# EAGLE design Spájkovačka 3000 MK.I (EAGLE 7.5.0)
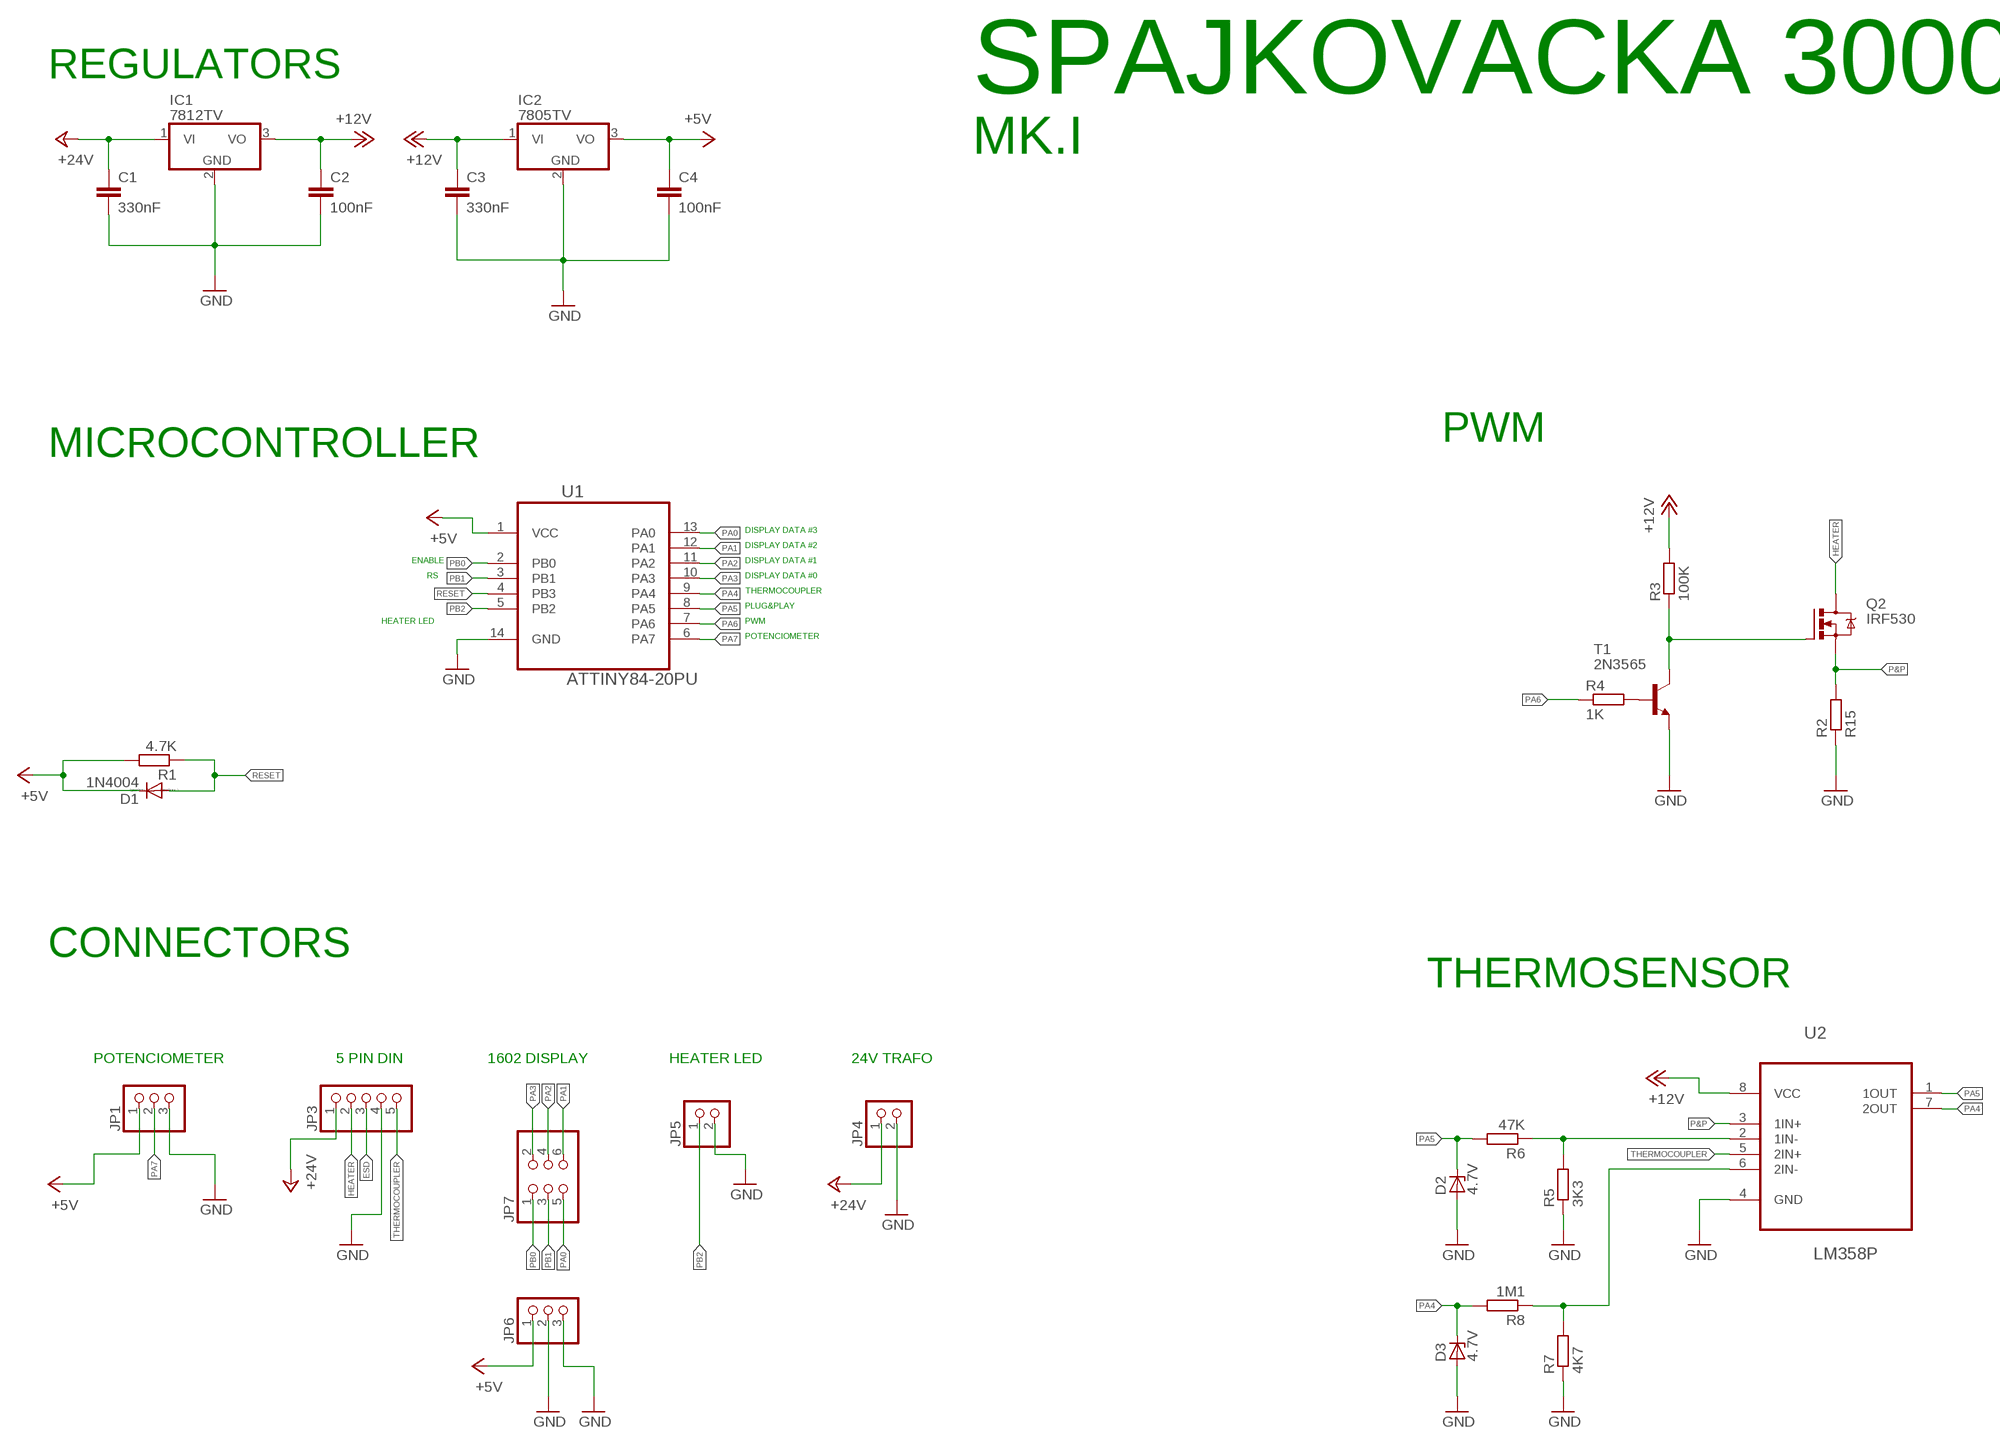
[diagram p0: schematic, sheet 1]

## Parts
C1  330nF  C-EU025-024X044  [C025-024X044]
C2  100nF  C-EU025-024X044  [C025-024X044]
C3  330nF  C-EU025-024X044  [C025-024X044]
C4  100nF  C-EU025-024X044  [C025-024X044]
D1  1N4004  [DO41-10]
D2  4.7V  ZENER-DIODEDO41Z10  [DO41Z10]
D3  4.7V  ZENER-DIODEDO41Z10  [DO41Z10]
IC1  7812TV  [TO220V]
IC2  7805TV  [TO220V]
JP1  PINHD-1X3  [1X03]
JP3  PINHD-1X5  [1X05]
JP4  PINHD-1X2  [1X02]
JP5  PINHD-1X2  [1X02]
JP6  PINHD-1X3  [1X03]
JP7  PINHD-2X3  [2X03]
Q2  IRF530  [TO220BV]
R1  4.7K  R-EU_0207/10  [0207/10]
R2  R15  R-EU_0922/22  [0922/22]
R3  100K  R-EU_0207/10  [0207/10]
R4  1K  R-EU_0207/10  [0207/10]
R5  3K3  R-EU_0207/10  [0207/10]
R6  47K  R-EU_0207/10  [0207/10]
R7  4K7  R-EU_0207/10  [0207/10]
R8  1M1  R-EU_0207/10  [0207/10]
T1  2N3565  [TO92]
U1  ATTINY84-20PU  [DIP254P762X533-14]
U2  LM358P  [DIP254P762X508-8]

## Nets
1IN-: R5.2 R6.1 U2.2(1IN-)
+5V: C4.1 D1.C IC2.3(VO) JP1.1 JP6.1 R1.2 U1.1(VCC)
+12V: C2.1 C3.1 IC1.3(VO) IC2.1(VI) R3.2 U2.8(VCC)
+24V: C1.1 IC1.1(VI) JP3.1 JP4.1
ESD: JP3.3
GND: C1.2 C2.2 C3.2 C4.2 D2.A D3.A IC1.2(GND) IC2.2(GND) JP1.3 JP3.4 JP4.2 JP5.2 JP6.2 JP6.3 R2.1 R5.1 R7.1 T1.3(E) U1.14(GND) U2.4(GND)
HEATER: JP3.2 Q2.D
N$1: R7.2 R8.1 U2.6(2IN-)
N$4: Q2.G R3.1 T1.1(C)
N$7: R4.2 T1.2(B)
P&P: Q2.S R2.2 U2.3(1IN+)
PA0: JP7.5 U1.13(PA0)
PA1: JP7.6 U1.12(PA1)
PA2: JP7.4 U1.11(PA2)
PA3: JP7.2 U1.10(PA3)
PA4: D3.C R8.2 U1.9(PA4) U2.7(2OUT)
PA5: D2.C R6.2 U1.8(PA5) U2.1(1OUT)
PA6: R4.1 U1.7(PA6)
PA7: JP1.2 U1.6(PA7)
PB0: JP7.1 U1.2(PB0)
PB1: JP7.3 U1.3(PB1)
PB2: JP5.1 U1.5(PB2)
RESET: D1.A R1.1 U1.4(PB3)
THERMOCOUPLER: JP3.5 U2.5(2IN+)

## Notes on the sheet
- REGULATORS
- SPAJKOVACKA 3000
- MK.I
- PWM
- MICROCONTROLLER
- DISPLAY DATA #3
- DISPLAY DATA #2
- ENABLE | DISPLAY DATA #1
- RS | DISPLAY DATA #0
- THERMOCOUPLER
- PLUG&PLAY
- HEATER LED | PWM
- POTENCIOMETER
- CONNECTORS
- THERMOSENSOR
- POTENCIOMETER | 5 PIN DIN | 1602 DISPLAY | HEATER LED | 24V TRAFO

## Library data of the parts
C1-C4 = resistor:C-EU: CAPACITOR, European symbol
D1 = diode:1N4004: DIODE general purpose rectifier, 1 A
D2 D3 = diode:ZENER-DIODE: Z-Diode
IC1 IC2 = linear:78*: Positive VOLTAGE REGULATOR Source: http://cache.national.com/ds/LM/LM78L05.pdf http://www.fairchildsemi.com/ds/LM/LM7805.pdf
JP1 JP6 = pinhead:PINHD-1X3: PIN HEADER
JP3 = pinhead:PINHD-1X5: PIN HEADER
JP4 JP5 = pinhead:PINHD-1X2: PIN HEADER
JP7 = pinhead:PINHD-2X3: PIN HEADER
Q2 = IRF530:IRF530: HEXFET Power MOSFET
R1-R8 = resistor:R-EU_: RESISTOR, European symbol
T1 = transistor:2N3565: NPN TRANSISTOR
U1 = ATTINY84-20PU:ATTINY84-20PU: 8-bit Microcontroller with In-System Programmable Flash
U2 = LM358P:LM358P: OPERATIONAL AMPLIFIERS

## Board
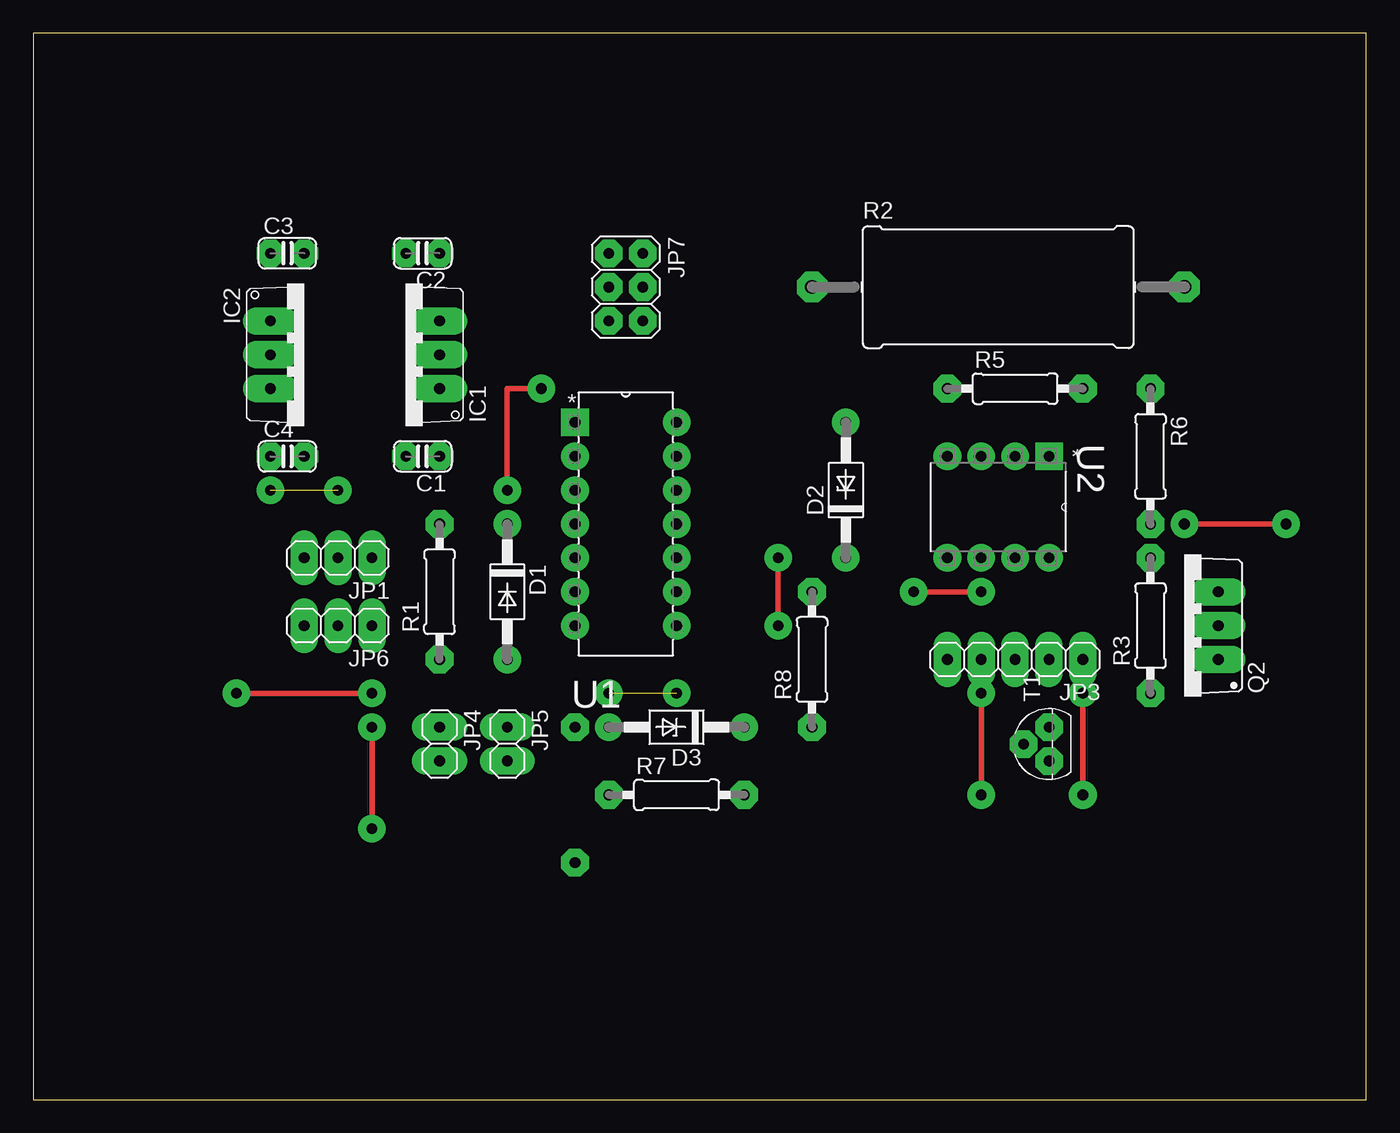
[diagram p1: board, top side]
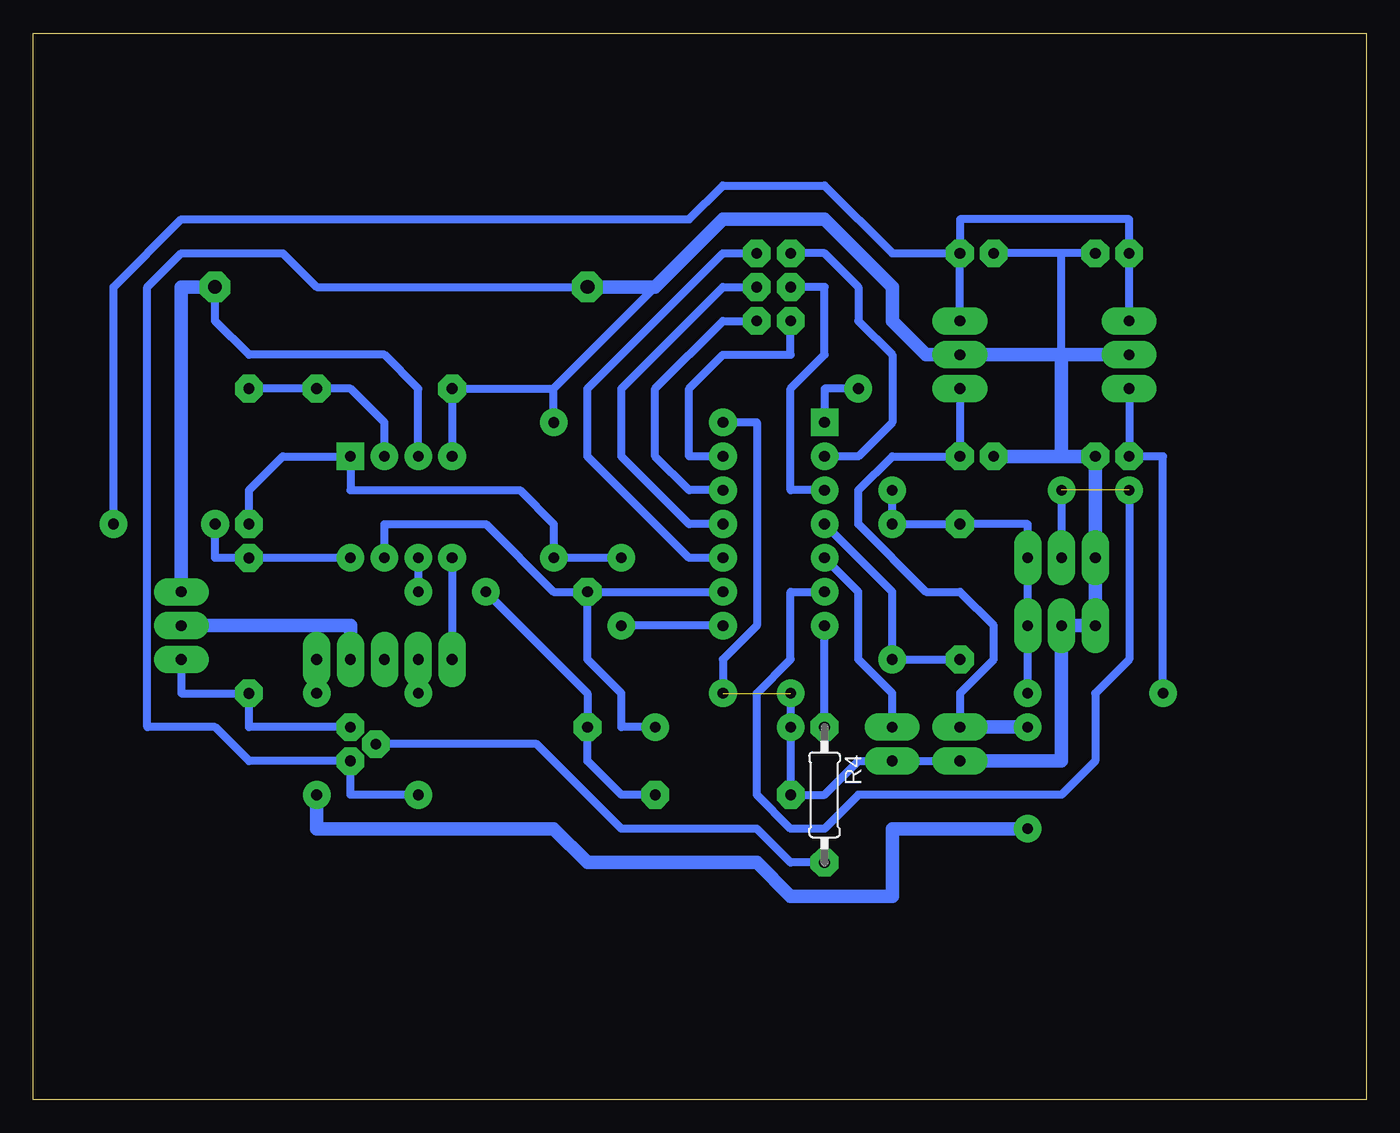
[diagram p2: board, bottom side, seen from below]

Size 100 x 80 mm. Coordinates in mm from the lower left corner, seen from the top.
Outline: 0,0 100,0 100,80 0,80 0,0
Copper layers (1*16): Top 0.035mm / dielectric 1.5mm / Bottom 0.035mm
Design rules "default *": minimum track width 10mil, minimum drill 24mil, track to track 8mil, track to pad 8mil, pad to pad 8mil, via to via 8mil, smd to smd 8mil, copper to edge 40mil, drill to drill 8mil, minimum pad ring 25mil, minimum via ring 25mil, stop-mask expansion 4mil, vias tented up to drill 0mil, thermal gap 10mil

### Footprints (pad centres in the part's own frame; a part is rotated, then mirrored left to right if it is on the bottom)
C025-024X044 = drill 0.8 octagon: 1 -1.27,0; 2 1.27,0
DO41-10 = drill 0.8: A 5.08,0; C -5.08,0
DO41Z10 = drill 0.8: A 5.08,0; C -5.08,0
TO220V = drill 0.8 long: 1 -2.54,-2.54; 2 0,-2.54; 3 2.54,-2.54
1X03 = drill 0.8 long: 1 -2.54,0; 2 0,0; 3 2.54,0
1X05 = drill 0.8 long: 1 -5.08,0; 2 -2.54,0; 3 0,0; 4 2.54,0; 5 5.08,0
1X02 = drill 0.8 long: 1 -1.27,0; 2 1.27,0
2X03 = drill 0.8 octagon: 1 -2.54,-1.27; 2 -2.54,1.27; 3 0,-1.27; 4 0,1.27; 5 2.54,-1.27; 6 2.54,1.27
TO220BV = drill 0.8 long: D 0,-2.54; G -2.54,-2.54; S 2.54,-2.54
0207/10 = drill 0.813 octagon: 1 -5.08,0; 2 5.08,0
0922/22 = drill 1.016 octagon: 1 -13.97,0; 2 13.97,0
TO92 = drill 0.8 octagon: 1 1.27,0; 2 0,1.905; 3 -1.27,0
DIP254P762X533-14 = drill 0.8 square: 1 -7.62,15.24 | drill 0.8: 2 -7.62,12.7; 3 -7.62,10.16; 4 -7.62,7.62; 5 -7.62,5.08; 6 -7.62,2.54; 7 -7.62,0; 8 0,0; 9 0,2.54; 10 0,5.08; 11 0,7.62; 12 0,10.16; 13 0,12.7; 14 0,15.24
DIP254P762X508-8 = drill 0.8 square: 1 -7.62,7.62 | drill 0.8: 2 -7.62,5.08; 3 -7.62,2.54; 4 -7.62,0; 5 0,0; 6 0,2.54; 7 0,5.08; 8 0,7.62

### Placement (x,y rotation side)
C1  29.21,48.26 180 top
C2  29.21,63.5 180 top
C3  19.05,63.5 0 top
C4  19.05,48.26 0 top
D1  35.56,38.1 270 top
D2  60.96,45.72 90 top
D3  48.26,27.94 180 top
IC1  27.94,55.88 90 top
IC2  20.32,55.88 270 top
JP1  22.86,40.64 180 top
JP3  73.66,33.02 180 top
JP4  30.48,26.67 270 top
JP5  35.56,26.67 270 top
JP6  22.86,35.56 180 top
JP7  44.45,60.96 270 top
Q2  86.36,35.56 90 top
R1  30.48,38.1 90 top
R2  72.39,60.96 0 top
R3  83.82,35.56 90 top
R4  40.64,22.86 270 bottom
R5  73.66,53.34 0 top
R6  83.82,48.26 270 top
R7  48.26,22.86 0 top
R8  58.42,33.02 90 top
T1  76.2,26.67 90 top
U1  48.26,35.56 0 top
U2  68.58,40.64 270 top

### Tracks (layer width: path | path; a pad name or v marks a point on that pad's centre or on a via)
1IN-
  Bottom 0.61: U2.2 73.66,50.8 76.2,53.34 R5.2 R6.1
+5V  (via drill 0.8)
  Top 0.406: v15.24,30.48 v25.4,30.48 | v35.56,45.72 35.56,53.34 v38.1,53.34
  Bottom 0.61: v35.56,45.72 D1.C R1.2 25.4,43.18 JP1.1 JP6.1 v25.4,30.48 | v15.24,30.48 15.24,48.26 C4.1 IC2.3 | v38.1,53.34 40.64,53.34 U1.1
+12V  (via drill 0.8)
  Top 0.406: v86.36,43.18 v93.98,43.18
  Bottom 0.61: IC1.3 C2.1 | C2.1 30.48,66.04 17.78,66.04 C3.1 IC2.1 | U2.8 R3.2 86.36,40.64 v86.36,43.18 | v93.98,43.18 93.98,60.96 88.9,66.04 50.8,66.04 48.26,68.58 40.64,68.58 35.56,63.5 C2.1
+24V  (via drill 0.8)
  Top 0.406: v25.4,27.94 v25.4,20.32 | v78.74,22.86 v78.74,30.48
  Bottom 0.61: IC1.1 C1.1 35.56,48.26 38.1,45.72 38.1,43.18 33.02,38.1 30.48,38.1 27.94,35.56 27.94,33.02 30.48,30.48 JP4.1
  Bottom 1.016: JP3.1 v78.74,30.48 | v25.4,20.32 35.56,20.32 35.56,15.24 43.18,15.24 45.72,17.78 58.42,17.78 60.96,20.32 78.74,20.32 v78.74,22.86 | v25.4,27.94 JP4.1
GND  (via drill 0.8)  (1 unrouted)
  Top 0.406: v71.12,22.86 v71.12,30.48
  Bottom 0.61: C3.2 22.86,63.5 | 22.86,63.5 C2.2 | 22.86,55.88 IC1.2 | IC2.2 22.86,55.88 | 22.86,55.88 22.86,63.5 | JP4.2 JP5.2 38.1,25.4 40.64,22.86 R7.1 D3.A v43.18,30.48 | U1.14 45.72,50.8 45.72,35.56 48.26,33.02 v48.26,30.48 | D2.A 60.96,53.34 | 60.96,53.34 53.34,60.96 | 60.96,53.34 R5.1 U2.4 | JP3.4 v71.12,30.48 | v71.12,22.86 76.2,22.86 T1.3 83.82,25.4 86.36,27.94 91.44,27.94 91.44,60.96 88.9,63.5 81.28,63.5 78.74,60.96 R2.1
  Bottom 1.016: C1.2 22.86,48.26 | 22.86,48.26 22.86,55.88 | 22.86,48.26 C4.2 JP1.3 JP6.3 JP6.2 22.86,25.4 JP4.2 | R2.1 53.34,60.96 48.26,66.04 40.64,66.04 35.56,60.96 35.56,58.42 33.02,55.88 IC1.2 IC2.2
HEATER
  Bottom 1.016: Q2.D 76.2,35.56 JP3.2
N$1  (via drill 0.8)
  Top 0.406: v66.04,38.1 v71.12,38.1
  Bottom 0.61: R7.2 55.88,22.86 58.42,25.4 R8.1 58.42,30.48 v66.04,38.1 | U2.6 v71.12,38.1
N$4
  Bottom 0.61: Q2.G 88.9,30.48 R3.1 83.82,27.94 T1.1
N$7
  Bottom 0.61: R4.2 43.18,17.78 45.72,20.32 55.88,20.32 62.23,26.67 T1.2
P&P
  Bottom 0.61: U2.3 71.12,53.34 73.66,55.88 83.82,55.88 86.36,58.42 R2.2
  Bottom 1.016: Q2.S 88.9,60.96 R2.2
PA0
  Bottom 0.61: U1.13 50.8,48.26 50.8,53.34 48.26,55.88 43.18,55.88 JP7.5
PA1
  Bottom 0.61: U1.12 50.8,45.72 53.34,48.26 53.34,53.34 48.26,58.42 JP7.6
PA2
  Bottom 0.61: U1.11 50.8,43.18 55.88,48.26 55.88,53.34 48.26,60.96 JP7.4
PA3
  Bottom 0.61: U1.10 50.8,40.64 58.42,48.26 58.42,53.34 48.26,63.5 JP7.2
PA4
  Bottom 0.61: R8.2 U1.9 | D3.C 55.88,27.94 55.88,30.48 58.42,33.02 R8.2 | U2.7 73.66,43.18 66.04,43.18 60.96,38.1 R8.2
PA5  (via drill 0.8)
  Top 0.406: v55.88,35.56 v55.88,40.64
  Bottom 0.61: U1.8 v55.88,35.56 | v55.88,40.64 D2.C 60.96,43.18 63.5,45.72 76.2,45.72 U2.1 81.28,48.26 83.82,45.72 R6.2
PA6
  Bottom 0.61: R4.1 U1.7
PA7  (via drill 0.8)  (1 unrouted)
  Bottom 0.61: v22.86,45.72 JP1.2 | v17.78,45.72 17.78,33.02 20.32,30.48 20.32,25.4 22.86,22.86 38.1,22.86 40.64,20.32 43.18,20.32 45.72,22.86 45.72,30.48 43.18,33.02 43.18,38.1 U1.6
PB0
  Bottom 0.61: JP7.1 40.64,63.5 38.1,60.96 38.1,58.42 35.56,55.88 35.56,50.8 38.1,48.26 U1.2
PB1
  Bottom 0.61: JP7.3 40.64,60.96 40.64,55.88 43.18,53.34 43.18,45.72 U1.3
PB2
  Bottom 0.61: JP5.1 35.56,30.48 38.1,33.02 38.1,38.1 U1.5
RESET
  Bottom 0.61: R1.1 D1.A 35.56,38.1 U1.4
THERMOCOUPLER
  Bottom 0.61: U2.5 JP3.5